# EAGLE design SensorIoTDisplay (EAGLE 9.6.1)
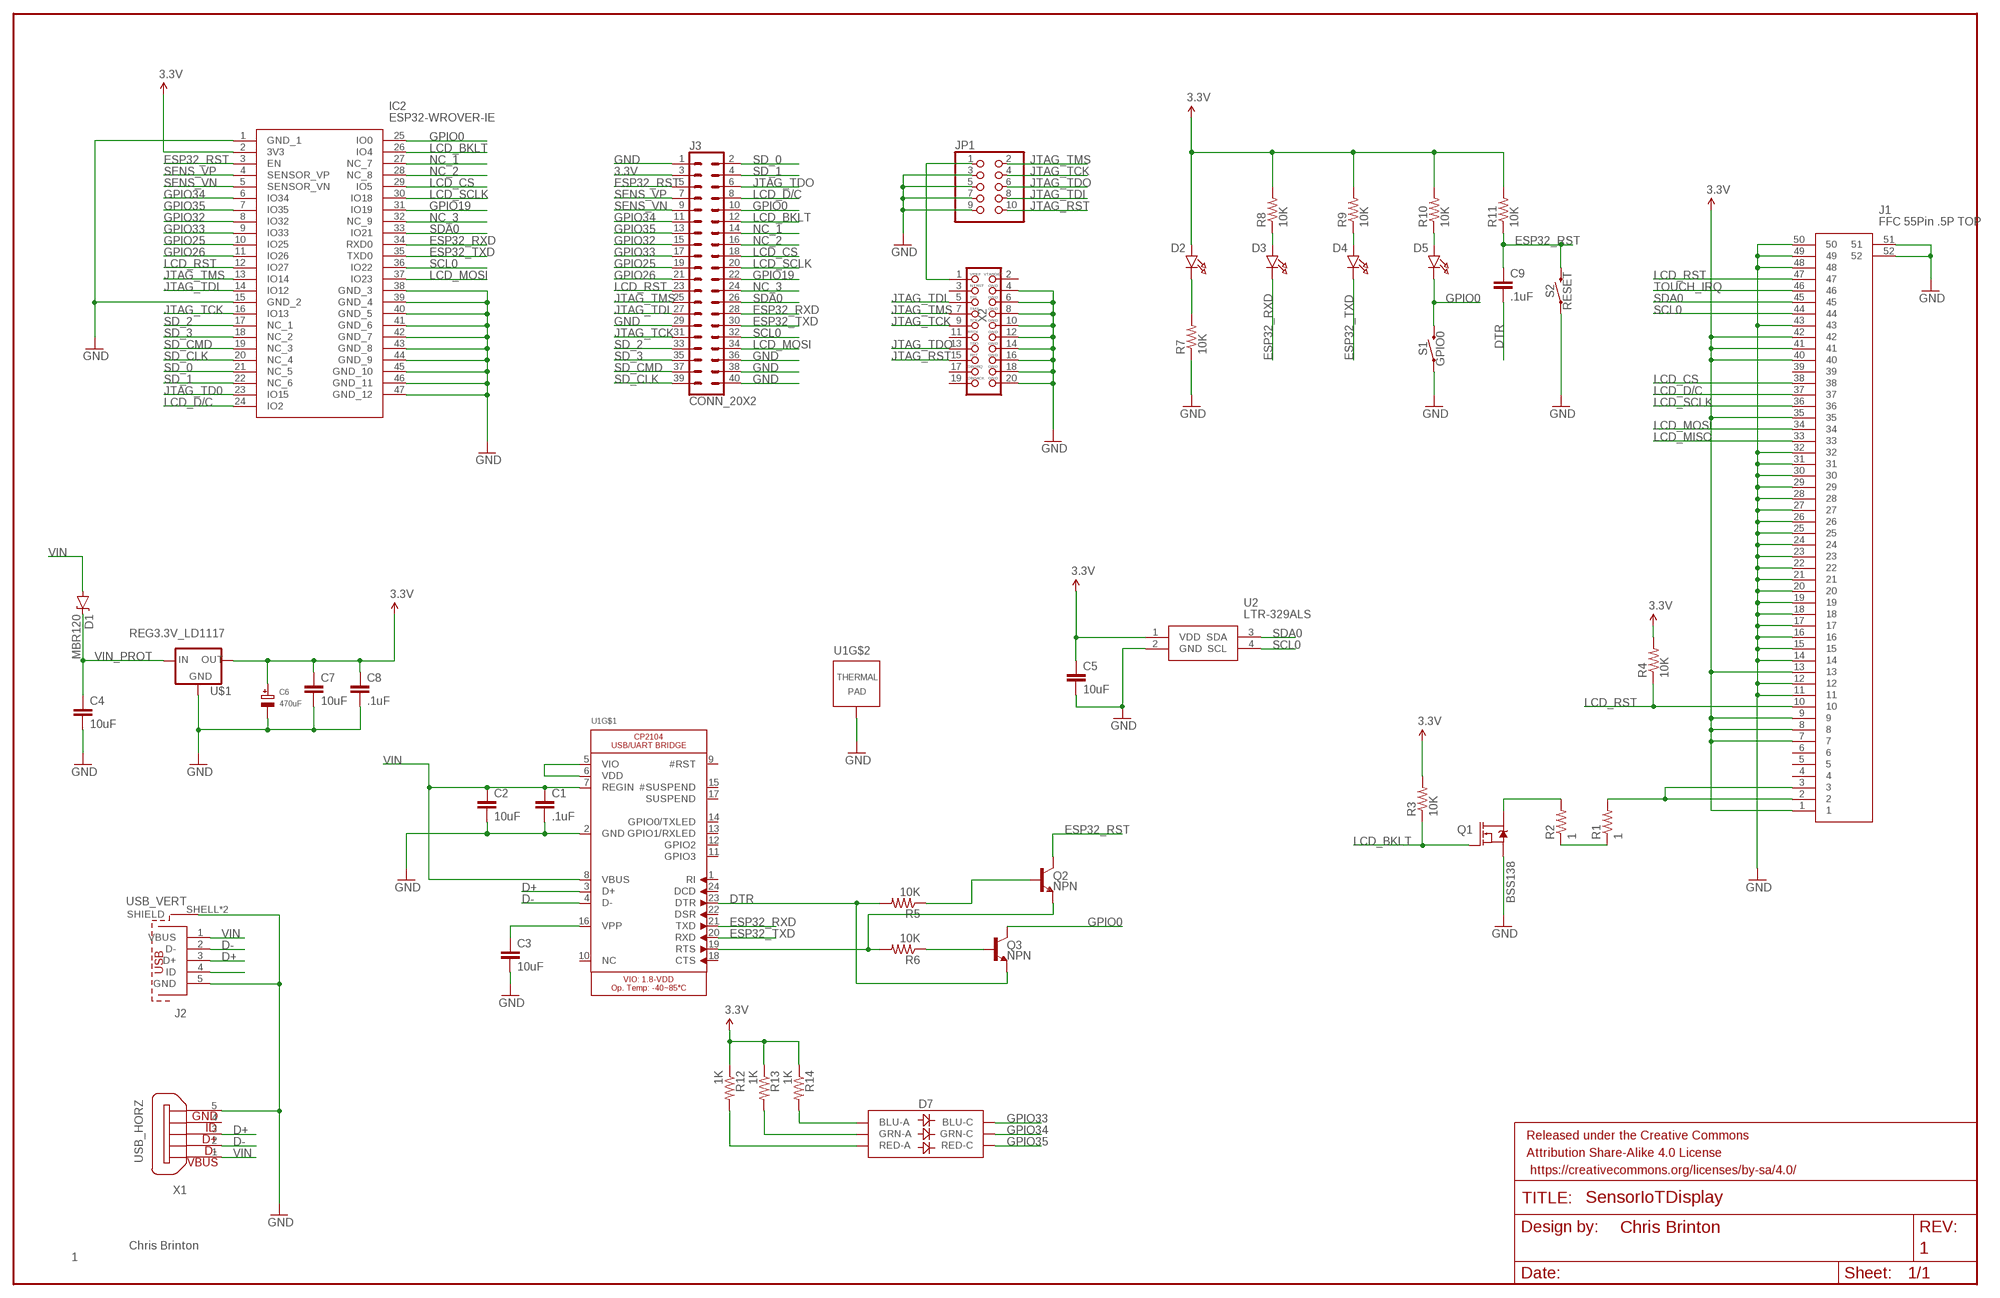
[diagram p0: schematic, sheet 1]

## Parts
C1  .1uF  CAP0805  [0805]
C2  10uF  CAP0805  [0805]
C3  10uF  CAP0805  [0805]
C4  10uF  CAP0805  [0805]
C5  10uF  CAP0805  [0805]
C6  470uF  CAP_TANTALUMD/7343_REFLOW  [EIA7343-31/D-R]
C7  10uF  CAP0805  [0805]
C8  .1uF  CAP0805  [0805]
C9  .1uF  CAP0805  [0805]
D1  MBR120  DIODE-ZENER16V  [SOD-123]
D2  RED  LED0805_NOOUTLINE  [CHIPLED_0805_NOOUTLINE]
D3  GREEN  LED0805_NOOUTLINE  [CHIPLED_0805_NOOUTLINE]
D4  BLUE  LED0805_NOOUTLINE  [CHIPLED_0805_NOOUTLINE]
D5  BLUE  LED0805_NOOUTLINE  [CHIPLED_0805_NOOUTLINE]
D7  LED-RGBNO_IC  [LED-TRICOLOR-5050]
FRAME1  FRAME-LEDGER  [CREATIVE_COMMONS]
IC2  ESP32-WROVER-IE  ESP32-WROVER-IE_M213EH6464UH3Q  [ESP32WROVERIEM213EH6464UH3Q0]
J1  FFC 55Pin .5P TOP  FH12A-50S-0.5SH_55_  [FH12A50S05SH55]
J2  USB_VERT  614105150621  [614105150621]
J3  CONN_20X2  [2X20]
JP1  HEADER-2X51.27MM  [2X05_1.27MM_SMT]
Q1  BSS138  MOSFET-NCH-BSS138  [SOT23-3]
Q2  NPN  TRANS_NPN-MMBT2222AL  [SOT23-3]
Q3  NPN  TRANS_NPN-MMBT2222AL  [SOT23-3]
R1  1  RESISTOR0805-RES  [0805]
R2  1  RESISTOR0805-RES  [0805]
R3  10K  RESISTOR0805-RES  [0805]
R4  10K  RESISTOR0805-RES  [0805]
R5  10K  RESISTOR0805-RES  [0805]
R6  10K  RESISTOR0805-RES  [0805]
R7  10K  RESISTOR0805-RES  [0805]
R8  10K  RESISTOR0805-RES  [0805]
R9  10K  RESISTOR0805-RES  [0805]
R10  10K  RESISTOR0805-RES  [0805]
R11  10K  RESISTOR0805-RES  [0805]
R12  1K  RESISTOR0805-RES  [0805]
R13  1K  RESISTOR0805-RES  [0805]
R14  1K  RESISTOR0805-RES  [0805]
S1  GPIO0  MOMENTARY-SWITCH-SPST-SMD-4.6X2.8MM  [TACTILE_SWITCH_SMD_4.6X2.8MM]
S2  RESET  MOMENTARY-SWITCH-SPST-SMD-4.6X2.8MM  [TACTILE_SWITCH_SMD_4.6X2.8MM]
U1  CP2104  [QFN24_4MM_SMSC]
U2  LTR-329ALS  LTR-329ALS-01  [LTR329ALS01]
U$1  REG3.3V_LD1117  V_REG_LD1117VXXLD1117-SMD  [SOT223]
X1  USB_HORZ  ZX62D-B-5PA8  [ZX62D-B-5PA8]
X2  MICROBUILDER_JTAG-ARM7SMT_FEMALE  [MICROBUILDER_2X10_SMT_FEMALE]

## Nets
3.3V: C5.1 C6.+ C7.1 C8.1 D2.A IC2.2(3V3) J1.1 J1.7 J1.8 J1.9 J1.13 J1.35 J1.40 J1.41 J1.42 J3.3 R3.2 R4.2 R8.2 R9.2 R10.2 R11.2 R12.1 R13.1 R14.1 U2.1(VDD) U$1.2(OUT)
D+: J2.3(D+) U1.3(D+) X1.3
D-: J2.2(D-) U1.4(D-) X1.2
DTR: C9.2 Q3.2(E) R5.2 U1.23(DTR)
ESP32_RST: C9.1 IC2.3(EN) J3.5 Q2.3(C) R11.1 S2.3 S2.4
ESP32_RXD: D3.C IC2.34(RXD0) J3.28 U1.21(TXD)
ESP32_TXD: D4.C IC2.35(TXD0) J3.30 U1.20(RXD)
GND: C1.2 C2.2 C3.2 C4.2 C5.2 C6.- C7.2 C8.2 IC2.1(GND_1) IC2.15(GND_2) IC2.38(GND_3) IC2.39(GND_4) IC2.40(GND_5) IC2.41(GND_6) IC2.42(GND_7) IC2.43(GND_8) IC2.44(GND_9) IC2.45(GND_10) IC2.46(GND_11) IC2.47(GND_12) J1.11 J1.12 J1.14 J1.15 J1.16 J1.17 J1.18 J1.19 J1.20 J1.21 J1.22 J1.23 J1.24 J1.25 J1.26 J1.27 J1.28 J1.29 J1.30 J1.31 J1.32 J1.43 J1.48 J1.49 J1.50 J1.51 J1.52 J2.5(GND) J2.SHELL1(SHIELD) J2.SHELL(SHIELD) J3.1 J3.29 J3.36 J3.38 J3.40 JP1.3 JP1.5 JP1.7 JP1.9 Q1.2(S) R7.1 S1.1 S1.2 S2.1 S2.2 U1.2(GND) U1.THERM(TP) U2.2(GND) U$1.1(GND) X1.5 X2.4 X2.6 X2.8 X2.10 X2.12 X2.14 X2.16 X2.18 X2.20
GPIO0: D5.C IC2.25(IO0) J3.10 Q3.3(C) S1.3 S1.4
GPIO19: IC2.31(IO19) J3.22
GPIO25: IC2.10(IO25) J3.19
GPIO26: IC2.11(IO26) J3.21
GPIO32: IC2.8(IO32) J3.15
GPIO33: D7.4(BLU-C) IC2.9(IO33) J3.17
GPIO34: D7.6(GRN-C) IC2.6(IO34) J3.11
GPIO35: D7.5(RED-C) IC2.7(IO35) J3.13
JTAG_RST: JP1.10 X2.15
JTAG_TCK: IC2.16(IO13) J3.31 JP1.4 X2.9
JTAG_TD0: IC2.23(IO15)
JTAG_TDI: IC2.14(IO12) J3.27 JP1.8 X2.5
JTAG_TDO: J3.6 JP1.6 X2.13
JTAG_TMS: IC2.13(IO14) J3.25 JP1.2 X2.7
LCD_BKLT: IC2.26(IO4) J3.12 Q1.1(G) R3.1
LCD_CS: IC2.29(IO5) J1.38 J3.18
LCD_D/C: IC2.24(IO2) J1.37 J3.8
LCD_MISO: J1.33
LCD_MOSI: IC2.37(IO23) J1.34 J3.34
LCD_RST: IC2.12(IO27) J1.10 J1.47 J3.23 R4.1
LCD_SCLK: IC2.30(IO18) J1.36 J3.20
N$1: R1.1 R2.1
N$2: J1.2 J1.3 R1.2
N$3: Q1.3(D) R2.2
N$4: U1.5(VIO) U1.6(VDD)
N$6: C3.1 U1.16(VPP)
N$7: D7.1(GRN-A) R13.2
N$8: J2.4(ID)
N$9: Q2.2(E) R6.2 U1.19(RTS)
N$10: Q3.1(B) R6.1
N$11: Q2.1(B) R5.1
N$12: D2.C R7.2
N$13: D7.2(RED-A) R12.2
N$14: D7.3(BLU-A) R14.2
N$15: D3.A R8.1
N$16: D4.A R9.1
N$17: D5.A R10.1
N$80: JP1.1 X2.1
NC_1: IC2.27(NC_7) J3.14
NC_2: IC2.28(NC_8) J3.16
NC_3: IC2.32(NC_9) J3.24
SCL0: IC2.36(IO22) J1.44 J3.32 U2.4(SCL)
SD_0: IC2.21(NC_5) J3.2
SD_1: IC2.22(NC_6) J3.4
SD_2: IC2.17(NC_1) J3.33
SD_3: IC2.18(NC_2) J3.35
SD_CLK: IC2.20(NC_4) J3.39
SD_CMD: IC2.19(NC_3) J3.37
SDA0: IC2.33(IO21) J1.45 J3.26 U2.3(SDA)
SENS_VN: IC2.5(SENSOR_VN) J3.9
SENS_VP: IC2.4(SENSOR_VP) J3.7
TOUCH_IRQ: J1.46
VIN: C1.1 C2.1 D1.A J2.1(VBUS) U1.7(REGIN) U1.8(VBUS) X1.1
VIN_PROT: C4.1 D1.C U$1.3(IN)
Unconnected: J1.4 J1.5 J1.6 J1.39 U1.1(RI) U1.9(#RST) U1.10(NC) U1.11(GPIO3) U1.12(GPIO2) U1.13(GPIO1/RXLED) U1.14(GPIO0/TXLED) U1.15(#SUSPEND) U1.17(SUSPEND) U1.18(CTS) U1.22(DSR) U1.24(DCD) X1.4 X1.S1 X1.S2 X1.S3 X1.S4 X2.2 X2.3 X2.11 X2.17 X2.19

## Library data of the parts
C1-C5 C7-C9 = SparkFun-Passives:CAP: Capacitor Standard 0603 ceramic capacitor, and 0.1" leaded capacitor.
C6 = GDTech:CAP_TANTALUM: Tantalum Capacitors Wave footprints have larger pads and are meant to be used for hand soldering. Reflow footprints are optimised for solder paste and a reflow oven. EIA3216-18/A-[R/W] - Size A / 3216-18 / 1206 footprint 4.7µF 25V 10% Tantalum Capacitor 10µF 16V 10% Tantalum Capacitor [Digikey: 495-2236-2-ND] EIA3528-21/B-[R/W] - Size B / 3528-21 47µF 10V 10% Tantalum Capactior [Digikey: 495-2216-1-ND] EIA6032-28/C-[R/W] - Size C / 6032-28 10µF 35V 20% Tantalum Capacitor [Digikey: 495-2285-1-ND] 100µF 16V 10% Tantalum Capactior [Digikey: 399-5214-1-ND]
D1 = SparkFun-DiscreteSemi:DIODE-ZENER: Zener Diode Production Part - 8199 3.4V Zener Voltage; PROD_ID: DIO-12440; VALUE: 16V
D2-D5 = microbuilder:LED: LED 0603 - 0603 Surface Mount Package 2mA: Green LED - Low Power (3.9mcd, 2ma, 1.7Vf) - Digikey: 475-2709-2-ND Orange LED - Low Power (9.8mcd, 2ma, 1.8Vf) - Digikey: 475-1194-2-ND Red LED - Low Power (5mcd, 2ma, 1.8Vf) - Digikey: 475-1195-2-ND Yellow LED - Low Power (7mcd, 2ma, 1.8Vf) - Digikey: 475-1196-2-ND 5mA: Blue LED - Low Power (17mcd, 5ma, 2.9Vf) - Digikey: LNJ937W8CRACT-ND 0805 - 0805 Surface Mount Package 2mA: Red LED (8.8mcd, 2mA, 1.8Vf, Clear) - Low Power [Digikey: 475-2510-1-ND] Green LED (5mcd, 2mA, 1.8Vf, Clear) - Low Power [Digikey: 475-2730-1-ND] Yellow LED (11.3mcd, 2mA, 1.8Vf, Clear) - Low Power [Digikey: 475-2555-1-ND] 20mA: Red LED (104mcd, 20mA, Diffused) - LS R976 [Digikey: 475-1278-6-ND] Red LED (12mcd, 20mA, 2.0Vf, Clear) - APT2012EC [Digikey: 754-1128-1-ND] Green LED (15mcd, 20mA, 2.2Vf, Clear) - APT2012GC [Digikey: 754-1131-1-ND] Orange LED (160mcd, 20mA, 2.1Vf, Clear) - APT2012SECK [Digikey: 754-1130-1-ND] 1206 - 1206 Surface Mount Package Green LED (26mcd, 20mA, Diffused) - LG N971 [Digikey: 475-1407-6-ND] Red LED (15mcd, 20mA, Diffused) - LH N974 [Digikey: 475-1416-6-ND]
D7 = SparkFun-LED:LED-RGB: LED-RGB 6 pin RGB LED (no common connector) Packages: PLCC-6 LED-TRICOLOR-5050 - No built-in IC SparkFun Products: Digital Sandbox <https://www.sparkfun.com/products/12651> LED- SMD RGB <https://www.sparkfun.com/products/10866>; PROD_ID: DIO-10298
FRAME1 = SparkFun-Aesthetics:FRAME-LEDGER: Schematic Frame - Ledger Standard 11x14 US Ledger frame; DESIGNER: Chris Brinton; REV: 1
IC2 = SamacSys_Parts:ESP32-WROVER-IE_M213EH6464UH3Q: WiFi Modules (802.11) SMD Module ESP32-WROVER-IE, ESP32-D0WD-V3, 3.3V 64Mbit PSRAM, 8 MB SPI flash, IPEX connector Source: Datasheet <https://www.mouser.fr/datasheet/2/891/esp32_wrover_e_esp32_wrover_ie_datasheet_en-1855913.pdf>; DESCRIPTION: WiFi Modules (802.11) SMD Module ESP32-WROVER-IE, ESP32-D0WD-V3, 3.3V 64Mbit PSRAM, 8 MB SPI flash, IPEX connector; HEIGHT: 3.45mm; MANUFACTURER_NAME: Espressif Systems; MANUFACTURER_PART_NUMBER: ESP32-WROVER-IE(M213EH6464UH3Q0); MOUSER_PART_NUMBER: 356-ESP32WRVIE6464UC; MOUSER_PRICE-STOCK: https://www.mouser.co.uk/ProductDetail/Espressif-Systems/ESP32-WROVER-IEM213EH6464UH3Q0?qs=vmHwEFxEFR8dEk%2F0jf8bsw%3D%3D
J1 = SamacSys_Parts:FH12A-50S-0.5SH_55_: FFC,0.5mm Pitch,Top Contact,50way Hirose FH12 Series 0.5mm Pitch 50 Way Right Angle SMT Female FPC Connector, ZIF Top Contact Source: Datasheet <https://www.hirose.com/product/download/?distributor=digikey&type=2d&lang=en&num=FH12A-50S-0.5SH(55)>; ALLIED_NUMBER: R1051516; ALLIED_PRICE-STOCK: https://www.alliedelec.com/hirose-electric-fh12a-50s-0-5sh-55-/R1051516/; DESCRIPTION: FFC,0.5mm Pitch,Top Contact,50way Hirose FH12 Series 0.5mm Pitch 50 Way Right Angle SMT Female FPC Connector, ZIF Top Contact; HEIGHT: 2mm; MANUFACTURER_NAME: Hirose; MANUFACTURER_PART_NUMBER: FH12A-50S-0.5SH(55); MOUSER_PART_NUMBER: 798-FH12A-50S0.5SH55; MOUSER_PRICE-STOCK: https://www.mouser.co.uk/ProductDetail/Hirose-Connector/FH12A-50S-05SH55?qs=Ux3WWAnHpjCW291jqAYF8g%3D%3D; RS_PART_NUMBER: 6882833P; RS_PRICE-STOCK: http://uk.rs-online.com/web/p/products/6882833P
J2 = 614105150621:614105150621: WR-COM_USB_Micro Type AB_Vertical_THT; Micro Type AB Vertical THT - Tape & Reel not for Pick & Place machine Code : Con_I-O_COM_USB_2.0_AB_614105150621_614105150621 <http://katalog.we-online.de/media/images/eican/Con_I-O_COM_USB_2.0_AB_614105150621_pf2.jpg> Details see: http://katalog.we-online.de/em/datasheet/614105150621.pdf Created 12/08/2014, Dan Xu 2014 (C) Wurth Elektronik; AVAILABILITY: Unavailable; DESCRIPTION: Vertical Through Hole; Ver 2.0 Micro USB Connector Socket, 30 V ac, 1.8A WR-COM; MF: Wurth Electronics; MP: 614105150621; PACKAGE: None; PRICE: None
J3 = SparkFun-Connectors:CONN_20X2: Multi connection point. Often used as Generic Header-pin footprint for 0.1 inch spaced/style header connections On any of the 0.1 inch spaced packages, you can populate with these: Break Away Headers - Straight <https://www.sparkfun.com/products/116> (PRT-00116) Break Away Male Headers - Right Angle <https://www.sparkfun.com/products/553> (PRT-00553) Female Headers <https://www.sparkfun.com/products/115> (PRT-00115) Break Away Headers - Machine Pin <https://www.sparkfun.com/products/117> (PRT-00117) Break Away Female Headers - Swiss Machine Pin <https://www.sparkfun.com/products/743> (PRT-00743)
JP1 = microbuilder:HEADER-2X5: PIN HEADER
Q1 = SparkFun-DiscreteSemi:MOSFET-NCH: N-channel MOSFETs Voltage controlled devices that allow control of high current outputs. SparkFun Products: SparkFun OpenScale <https://www.sparkfun.com/products/13261> SparkFun Digital Sandbox <https://www.sparkfun.com/products/12651> SparkFun Monster Moto Shield <https://www.sparkfun.com/products/10182> SparkFun MOSFET Power Controller <https://www.sparkfun.com/products/11214>; PROD_ID: TRANS-00830; VALUE: 220mA/50V/3.5Ω
Q2 Q3 = SparkFun-DiscreteSemi:TRANS_NPN: NPN transistor Current controlled devices typically used to amplify current or used as a switch. BC547 - COM-08928 <http://www.sparkfun.com/products/8928> (TO-92 45V 100mA) (1.Collector 2.Base 3.Emitter) 2N3904 - COM-00521 <http://www.sparkfun.com/products/521> (TO-92 40V 200mA) (1.Emitter 2.Base 3.Collector) P2N2222A - COM-12852 <http://www.sparkfun.com/products/12852> (TO-92 40V 600mA) (1.Collector 2.Base 3.Emitter); PROD_ID: TRANS-08049; VALUE: 600mA/40V
R1-R14 = SparkFun-Passives:RESISTOR: Resistor Basic schematic elements and footprints for 0603, 1206, and PTH resistors.
S1 S2 = SparkFun-Switches:MOMENTARY-SWITCH-SPST: Momentary Switch (Pushbutton) - SPST Normally-open (NO) SPST momentary switches (buttons, pushbuttons). Variants PTH-12MM - 12mm square, through-hole Momentary Pushbutton Switch - 12mm Square <https://www.sparkfun.com/products/9190> (COM-09190) PTH-6.0MM, PTH-6.0MM-KIT - 6.0mm square, through-hole Mini Pushbutton Switch <https://www.sparkfun.com/products/97> (COM-00097) KIT package intended for soldering kit's - only one side of pads' copper is exposed. PTH-RIGHT-ANGLE-KIT - Right-angle, through-hole Right Angle Tactile Button <https://www.sparkfun.com/products/10791> - Used on SparkFun BigTime Watch Kit <https://www.sparkfun.com/products/11734> SMD-12MM - 12mm square, surface-mount Tactile Button - SMD (12mm) <https://www.sparkfun.com/products/12993> (COM-12993) Used on SparkFun PicoBoard <https://www.sparkfun.com/products/11888> SMD-4.5MM - 4.5mm Square Trackball Switch Used on SparkFun Blackberry Trackballer Breakout <https://www.sparkfun.com/products/13169> SMD-4.6MMX2.8MM - 4.60mm x 2.80mm, surface mount Used on SparkFun SAMD21 Mini Breakout <https://www.sparkfun.com/products/13664> SMD-5.2MM, SMD-5.2-REDUNDANT - 5.2mm square, surface-mount Mini Pushbutton Switch - SMD <https://www.sparkfun.com/products/8720> (COM-08720) Used on Arduino Pro Mini <https://www.sparkfun.com/products/11114> REDUNDANT package connects both switch circuits together SMD-6.0X3.5MM - 6.0 x 3.5mm, surface mount Momentary Reset Switch SMD <https://www.sparkfun.com/products/8229> (COM-08229) SMD-6.2MM-TALL - 6.2mm square, surface mount Tactile Button - SMD (6mm) <https://www.sparkfun.com/products/12992> Used on SparkFun Digital Sandbox <https://www.sparkfun.com/products/12651> SMD-RIGHT-ANGLE - Right-angle, surface mount Used on SparkFun Block for Intel® Edison - Arduino <https://www.sparkfun.com/products/13036>; PROD_ID: SWCH-13065
U1 = GDTech:CP2104: CP2104 - USB to UART Bridge VDD Output: 3.45V
U2 = SamacSys_Parts:LTR-329ALS-01: Ambient Light Sensors Ambient Light Photo Sensor Source: Datasheet <http://www.mouser.com/ds/2/239/liteon_LTR-329ALS-01-1175539.pdf>; DESCRIPTION: Ambient Light Sensors Ambient Light Photo Sensor; HEIGHT: 0mm; MANUFACTURER_NAME: Lite-On; MANUFACTURER_PART_NUMBER: LTR-329ALS-01; MOUSER_PART_NUMBER: 859-LTR-329ALS-01; MOUSER_PRICE-STOCK: https://www.mouser.com/Search/Refine.aspx?Keyword=859-LTR-329ALS-01
U$1 = SparkFun-IC-Power:V_REG_LD1117VXX: LD1117VXX voltage regulator. We carry the 3.3V version (COM-00526) in TO-220 package.; PROD_ID: VREG-13917
X1 = GDTech:ZX62D-B-5PA8: Micro USB Type B Connector - Standard, Shell Through Hole Source: http://www.hirose.co.jp/cataloge_hp/ed_ZX_20140804.pdf; MF: Hirose; MPN: ZX62D-B-5PA8; OC_FARNELL: 2300438; OC_NEWARK: 69W0712
X2 = Adafruit JTAG to SWD Adapter:MICROBUILDER_JTAG-ARM7: 20 Pin JTAG Connector For use with ARM7, and ARM9. Supported by some Cortex M3 boards with SWJ-DP interfaces (dual SWP/JTAG support). PTH - 4UConnector: 03556 SMT_MALE - 4UConnector: 17654 SMT_FEMALE - 4UConnector: 03587

## Board
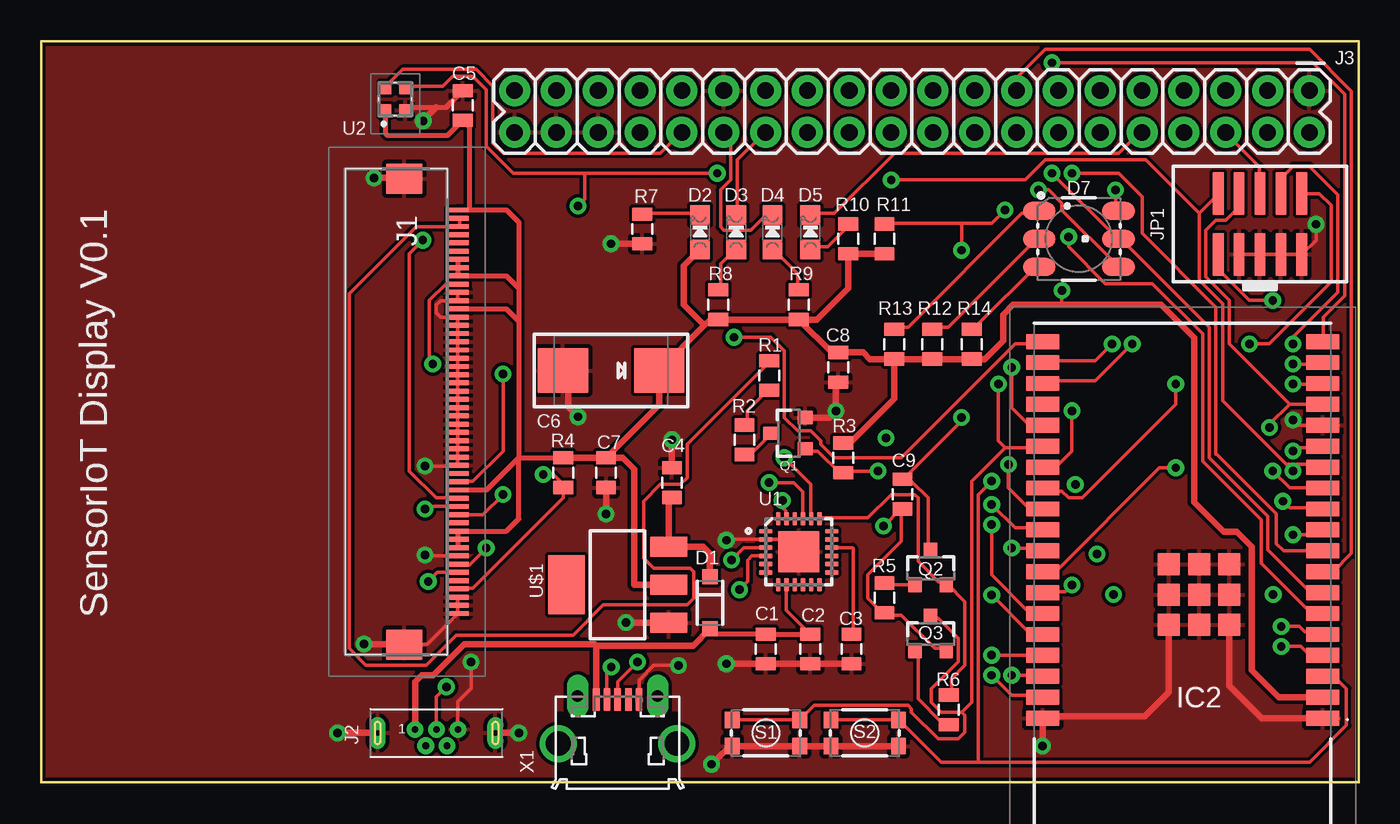
[diagram p1: board, top side]
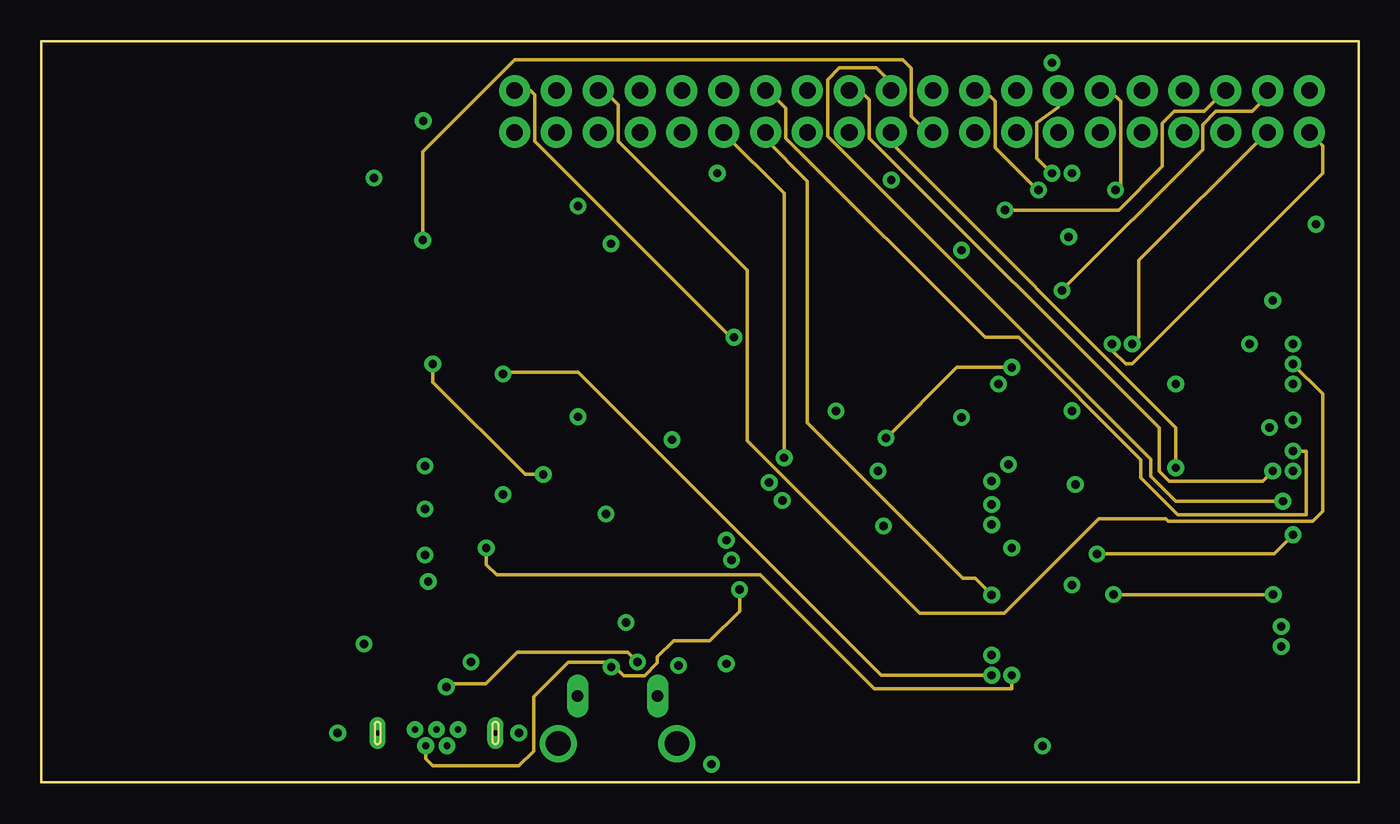
[diagram p2: board, inner layer Route2]
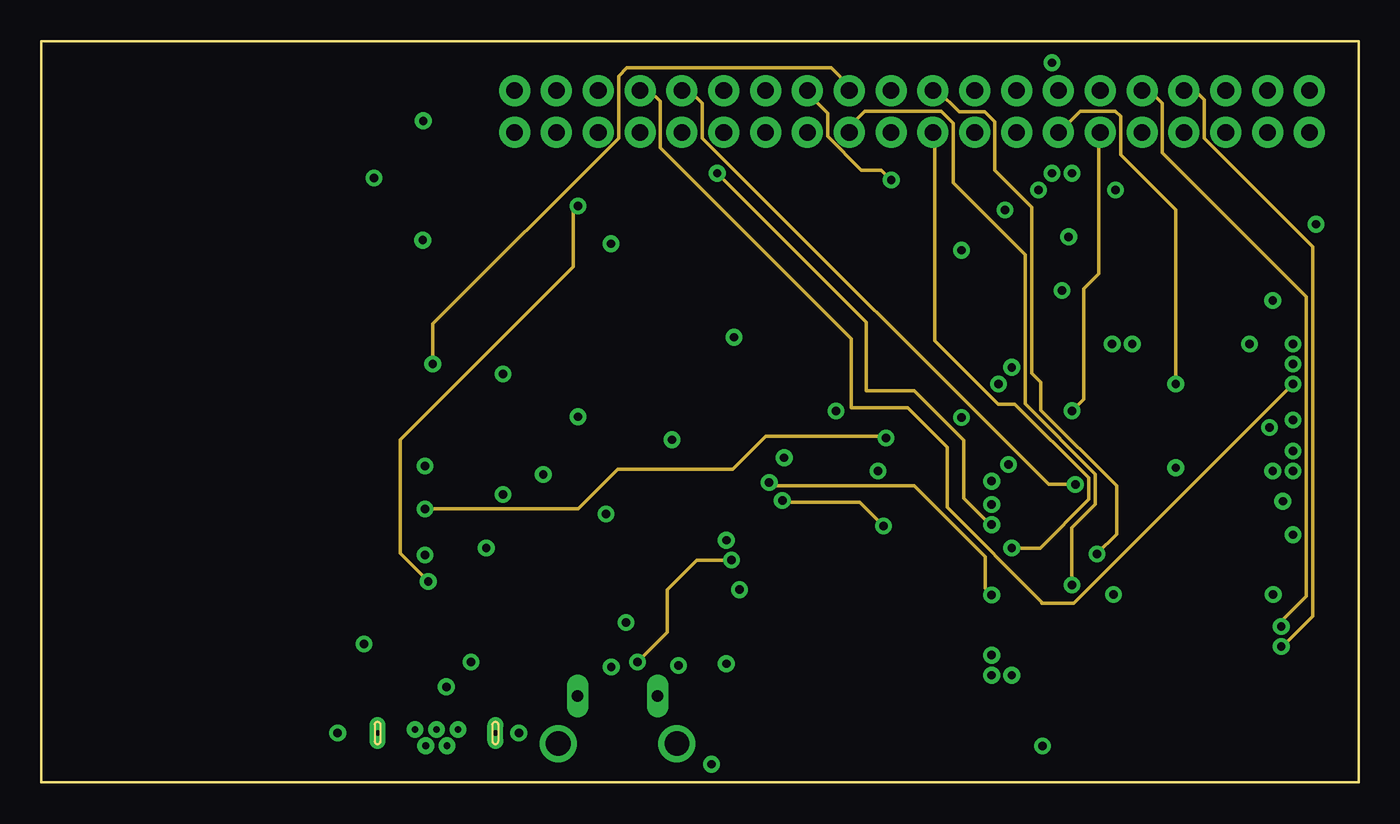
[diagram p3: board, inner layer Route15]
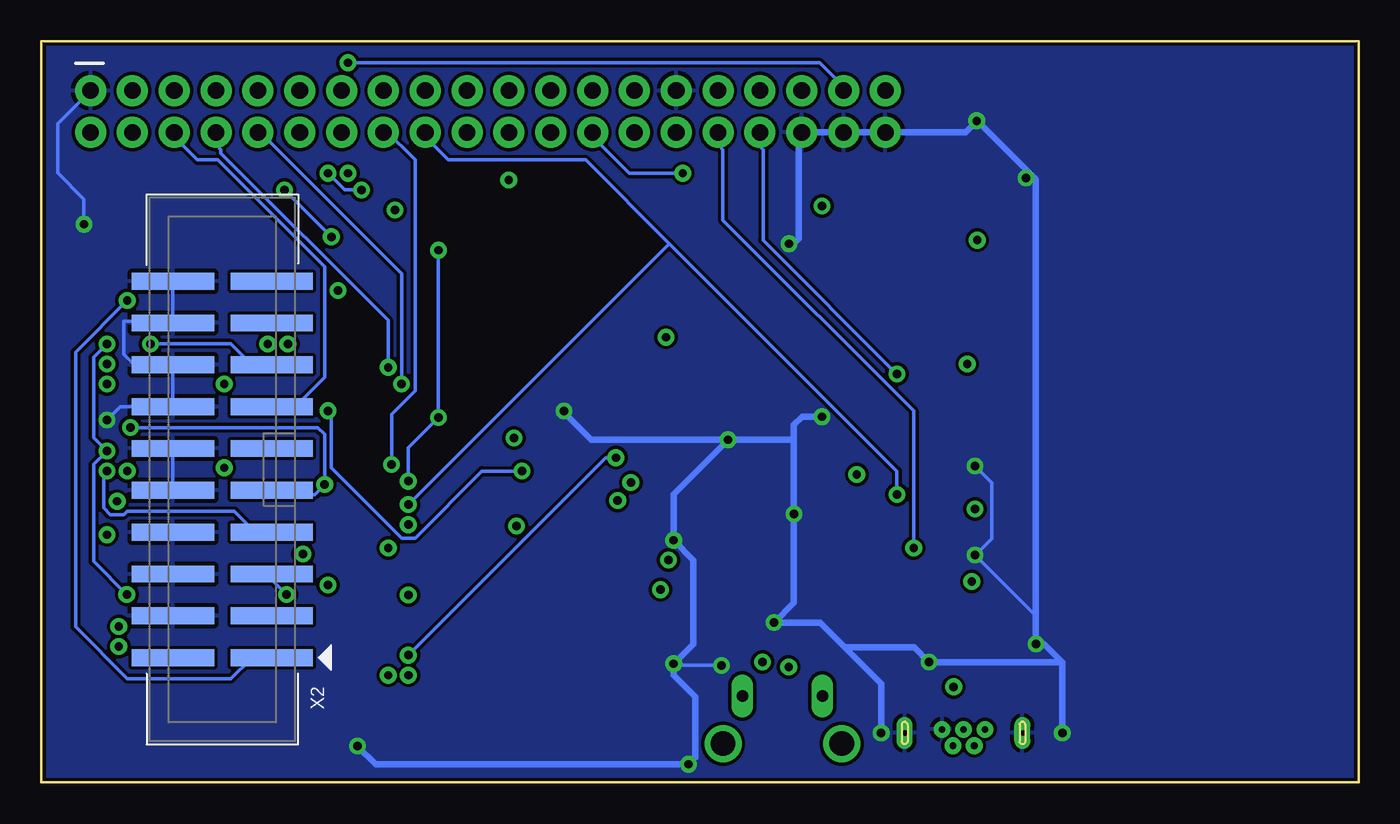
[diagram p4: board, bottom side, seen from below]

Size 80 x 45 mm. Coordinates in mm from the lower left corner, seen from the top.
Outline: 0,0 0,45 80,45 80,0 0,0
Copper layers (1+2*15+16): Top 0.035mm / dielectric 0.2mm / Route2 0.0175mm / dielectric 1.065mm / Route15 0.0175mm / dielectric 0.2mm / Bottom 0.035mm
Design rules "SparkFun *": minimum track width 8mil, minimum drill 20mil, track to track 8mil, track to pad 8mil, pad to pad 8mil, via to via 8mil, smd to smd 8mil, copper to edge 8mil, drill to drill 8mil, minimum pad ring 12mil, minimum via ring 10mil, stop-mask expansion 4mil, vias tented up to drill 20mil, thermal gap 10mil

### Footprints (pad centres in the part's own frame; a part is rotated, then mirrored left to right if it is on the bottom)
0805 = smd 0.8 x 1.2: 1 -0.9,0; 2 0.9,0
EIA7343-31/D-R = smd 3.048 x 2.7: + 2.921,0; - -2.921,0
SOD-123 = smd 0.9 x 0.95: A 1.575,0; C -1.575,0
CHIPLED_0805_NOOUTLINE = smd 1.2 x 1.2: A 0,-1.05; C 0,1.05
LED-TRICOLOR-5050 = smd 2 x 1.1: 1 -2.4,1.7; 2 -2.4,0; 3 -2.4,-1.7; 4 2.4,-1.7; 5 2.4,0; 6 2.4,1.7
ESP32WROVERIEM213EH6464UH3Q0 = smd 2 x 0.9: 1 0,0; 2 0,-1.27; 3 0,-2.54; 4 0,-3.81; 5 0,-5.08; 6 0,-6.35; 7 0,-7.62; 8 0,-8.89; 9 0,-10.16; 10 0,-11.43; 11 0,-12.7; 12 0,-13.97; 13 0,-15.24; 14 0,-16.51; 15 0,-17.78; 16 0,-19.05; 17 0,-20.32; 18 0,-21.59; 19 0,-22.86; 20 17,-22.86; 21 17,-21.59; 22 17,-20.32; 23 17,-19.05; 24 17,-17.78; 25 17,-16.51; 26 17,-15.24; 27 17,-13.97; 28 17,-12.7; 29 17,-11.43; 30 17,-10.16; 31 17,-8.89; 32 17,-7.62; 33 17,-6.35; 34 17,-5.08; 35 17,-3.81; 36 17,-2.54; 37 17,-1.27; 38 17,0 | smd 1.33 x 1.33: 39 7.5,-7.5; 40 7.5,-5.665; 41 9.335,-5.665; 42 9.335,-7.5; 43 9.335,-9.335; 44 7.5,-9.335; 45 5.665,-9.335; 46 5.665,-7.5; 47 5.665,-5.665
FH12A50S05SH55 = smd 0.3 x 1.3: 1 12.25,-3.1; 2 11.75,-3.1; 3 11.25,-3.1; 4 10.75,-3.1; 5 10.25,-3.1; 6 9.75,-3.1; 7 9.25,-3.1; 8 8.75,-3.1; 9 8.25,-3.1; 10 7.75,-3.1; 11 7.25,-3.1; 12 6.75,-3.1; 13 6.25,-3.1; 14 5.75,-3.1; 15 5.25,-3.1; 16 4.75,-3.1; 17 4.25,-3.1; 18 3.75,-3.1; 19 3.25,-3.1; 20 2.75,-3.1; 21 2.25,-3.1; 22 1.75,-3.1; 23 1.25,-3.1; 24 0.75,-3.1; 25 0.25,-3.1; 26 -0.25,-3.1; 27 -0.75,-3.1; 28 -1.25,-3.1; 29 -1.75,-3.1; 30 -2.25,-3.1; 31 -2.75,-3.1; 32 -3.25,-3.1; 33 -3.75,-3.1; 34 -4.25,-3.1; 35 -4.75,-3.1; 36 -5.25,-3.1; 37 -5.75,-3.1; 38 -6.25,-3.1; 39 -6.75,-3.1; 40 -7.25,-3.1; 41 -7.75,-3.1; 42 -8.25,-3.1; 43 -8.75,-3.1; 44 -9.25,-3.1; 45 -9.75,-3.1; 46 -10.25,-3.1; 47 -10.75,-3.1; 48 -11.25,-3.1; 49 -11.75,-3.1; 50 -12.25,-3.1 | smd 1.8 x 2.2: 51 -14.15,0.15; 52 14.15,0.15
614105150621 = drill 0.4: 1 -1.3,0.22; 2 -0.65,-0.78; 3 0,0.22; 4 0.65,-0.78; 5 1.3,0.22 | drill 0.35 pad 0.95 long: SHELL -3.575,0; SHELL1 3.575,0
2X20 = drill 1.016 pad 1.88: 1 0,0; 2 0,2.54; 3 2.54,0; 4 2.54,2.54; 5 5.08,0; 6 5.08,2.54; 7 7.62,0; 8 7.62,2.54; 9 10.16,0; 10 10.16,2.54; 11 12.7,0; 12 12.7,2.54; 13 15.24,0; 14 15.24,2.54; 15 17.78,0; 16 17.78,2.54; 17 20.32,0; 18 20.32,2.54; 19 22.86,0; 20 22.86,2.54; 21 25.4,0; 22 25.4,2.54; 23 27.94,0; 24 27.94,2.54; 25 30.48,0; 26 30.48,2.54; 27 33.02,0; 28 33.02,2.54; 29 35.56,0; 30 35.56,2.54; 31 38.1,0; 32 38.1,2.54; 33 40.64,0; 34 40.64,2.54; 35 43.18,0; 36 43.18,2.54; 37 45.72,0; 38 45.72,2.54; 39 48.26,0; 40 48.26,2.54
2X05_1.27MM_SMT = smd 0.65 x 2.6: 1 -2.54,-1.85; 2 -2.54,1.85; 3 -1.27,-1.85; 4 -1.27,1.85; 5 0,-1.85; 6 0,1.85; 7 1.27,-1.85; 8 1.27,1.85; 9 2.54,-1.85; 10 2.54,1.85
SOT23-3 = smd 0.8 x 0.9: 1 -0.95,-1; 2 0.95,-1; 3 0,1.1
TACTILE_SWITCH_SMD_4.6X2.8MM = smd 0.9 x 1: 1 -2.05,-0.8; 2 2.05,-0.8; 3 2.05,0.8; 4 -2.05,0.8
QFN24_4MM_SMSC = smd 0.8 x 0.28: 1 -2,1.25; 2 -2,0.75; 3 -2,0.25; 4 -2,-0.25; 5 -2,-0.75; 6 -2,-1.25; 13 2,-1.25; 14 2,-0.75; 15 2,-0.25; 16 2,0.25; 17 2,0.75; 18 2,1.25 | smd 0.28 x 0.8: 7 -1.25,-2; 8 -0.75,-2; 9 -0.25,-2; 10 0.25,-2; 11 0.75,-2; 12 1.25,-2; 19 1.25,2; 20 0.75,2; 21 0.25,2; 22 -0.25,2; 23 -0.75,2; 24 -1.25,2 | smd 2.5 x 2.5: THERM 0,0
LTR329ALS01 = smd 0.7 x 0.75: 1 -0.6,-0.4; 2 0.6,-0.4; 3 0.6,0.95; 4 -0.6,0.95
SOT223 = smd 1.219 x 2.235: 1 -2.311,-3.099; 2 0,-3.099; 3 2.311,-3.099 | smd 3.6 x 2.2: 4 0,3.099
ZX62D-B-5PA8 = smd 1.35 x 0.4: 1 4.825,1.3; 2 4.825,0.65; 3 4.825,0; 4 4.825,-0.65; 5 4.825,-1.3 | drill 1.5: S1 2.15,-3.6; S2 2.15,3.6 | drill 0.7 long: S3 5.05,2.425; S4 5.05,-2.425
MICROBUILDER_2X10_SMT_FEMALE = smd 1.02 x 5: 1 -11.43,-3; 2 -11.43,3; 3 -8.89,-3; 4 -8.89,3; 5 -6.35,-3; 6 -6.35,3; 7 -3.81,-3; 8 -3.81,3; 9 -1.27,-3; 10 -1.27,3; 11 1.27,-3; 12 1.27,3; 13 3.81,-3; 14 3.81,3; 15 6.35,-3; 16 6.35,3; 17 8.89,-3; 18 8.89,3; 19 11.43,-3; 20 11.43,3

### Placement (x,y rotation side)
C1  44,8.1 270 top
C2  46.7,8.1 270 top
C3  49.2,8.1 270 top
C4  38.3,18.2 90 top
C5  25.6,41.1 90 top
C6  34.6,25 0 top
C7  34.3,18.8 270 top
C8  48.4,25.2 270 top
C9  52.3,17.5 270 top
D1  40.6,10.9 270 top
D2  40,33.4 0 top
D3  42.2,33.4 0 top
D4  44.4,33.4 0 top
D5  46.7,33.4 0 top
D7  63,33 0 top
FRAME1  24.13,-7.62 0 top  (outside the outline)
IC2  77.8,3.9 180 top
J1  22.2,22.5 90 top
J2  24,3 0 top
J3  77,42 180 top
JP1  74,33.9 0 top
Q1  45.4,21.2 90 top
Q2  54,13 0 top
Q3  54,9 0 top
R1  44.2,24.7 90 top
R2  42.7,20.8 270 top
R3  48.7,19.7 90 top
R4  31.7,18.8 90 top
R5  51.2,11.2 270 top
R6  55.1,4.4 90 top
R7  36.5,33.6 90 top
R8  41.1,29 270 top
R9  46,29 270 top
R10  49,33 270 top
R11  51.2,33 270 top
R12  54.1,26.6 90 top
R13  51.8,26.6 90 top
R14  56.5,26.6 90 top
S1  44,3 0 top
S2  50,3 0 top
U1  46,14 0 top
U2  21.5,41.2 0 top
U$1  35,12 90 top
X1  35,0.2 90 top
X2  69,19 90 bottom

### Tracks (layer width: path | path; a pad name or v marks a point on that pad's centre or on a via)
3.3V  (via drill 0.51)
  Top 0.203: J1.41 25.4,14.83 25.3,14.83 | 26.01,34.75 26,34.76 | J1.8 25.4,31.29 25.3,31.29 | 61.98,29 v61.98,29.87
  Top 0.305: J1.35 27.05,17.75 29,19.7 | 29,19.7 R4.2 | 29,19.7 29,16 28.25,15.25 J1.40 25.3,14.83 J1.41 J1.42 | 29,28 29,19.7 | J1.13 28.25,28.75 29,28 | J1.7 25.3,31.29 J1.8 J1.9 28.25,30.75 29,30 | 29,30 29,28 | J1.1 26.01,34.75 28.25,34.75 29,34 29,30 | 26,34.76 26,39.8 C5.1 24.7,39.3 21,39.3 20.9,39.4 U2.1
  Top 0.406: U$1.2 36,12 36,19 35.3,19.7 C7.1 | C7.1 R4.2 | C7.1 37.52,22.92 C6.+ 40.26,27.74 | 40.26,27.74 40.62,28.1 R8.2 R9.2 | D2.A 39,31.35 39,29 40.26,27.74 | R9.2 48,26.1 C8.1 49.9,26.1 50.3,25.7 R13.1 | R9.2 47.1,28.1 49,30 R10.2 R11.2 | R13.1 R12.1 R14.1 57.3,25.7 58.4,26.8 58.4,28.4 59,29 61.98,29 68,29 70,27 70,17 71.8,15.2 72.6,15.2 73.5,14.3 73.5,6.8 75.13,5.17 IC2.2 | R3.2 49.1,20.6 51.8,23.3 R13.1
  Route2 0.203: J3.3 74.46,41.66 73.54,40.74 71.33,40.74 70.51,39.92 70.51,38.41 v61.98,29.87
D+  (via drill 0.51)
  Top 0.203: J2.3 24,5.2 v24.6,5.8 | X1.3 35,6.1 v36.2,7.3 | v41.91,13.5 42.66,14.25 U1.3
  Route2 0.203: v24.6,5.8 24.8,6 27,6 28.9,7.9 35.6,7.9 v36.2,7.3
  Route15 0.203: v36.2,7.3 38,9.1 38,11.7 39.8,13.5 v41.91,13.5
D-  (via drill 0.51)
  Top 0.203: v34.61,7 34.35,6.74 X1.2 | U1.4 43.15,13.75 42.9,13.5 42.9,12.2 v42.4,11.7
  Route2 0.203: J2.2 23.35,1.42 23.77,1 29,1 29.9,1.9 29.9,5.2 32,7.3 34.31,7.3 v34.61,7 34.51,6.9 34.95,6.9 35.36,6.49 36.64,6.49 37.41,7.26 37.41,7.61 38.4,8.6 40.6,8.6 42.4,10.4 v42.4,11.7
DTR  (via drill 0.51)
  Top 0.203: Q3.2 54.86,8.13 54.25,8.13 52.22,10.16 51.21,10.16 R5.2 51,10.36 50.19,11.18 50.19,12.6 52.22,14.63 52.22,16.46 C9.2 52.19,16.6 v51.14,15.56 | U1.23 45.2,16.05 45.2,16.48 45,16.68 v45,17.11
  Route15 0.203: v45,17.11 45.11,17 49.7,17 v51.14,15.56
ESP32_RST  (via drill 0.51)
  Top 0.203: S2.4 S2.3 52.22,3.66 54.66,1.22 56.9,1.22 | 56.9,1.22 77.01,1.22 79.25,3.45 79.25,5.69 78.64,6.3 77.83,6.3 IC2.3 | Q2.3 53.85,14.22 53.85,17.27 52.83,18.29 52.43,18.29 C9.1 52.43,18.49 55.88,21.95 v55.88,22.15 | 55.88,33.93 57.71,33.93 v58.52,34.75 | 55.88,33.93 51.21,33.93 R11.1 | 55.88,33.93 v55.88,32.31 | 56.9,1.22 56.9,17.48 v57.71,18.29
  Route2 0.203: v58.52,34.75 65.43,34.75 68.08,37.4 68.08,40.03 68.79,40.74 70.61,40.74 71.73,41.86 J3.5
  Bottom 0.203: v55.88,32.31 v55.88,22.15 57.71,20.32 v57.71,18.29
ESP32_RXD  (via drill 0.51)
  Top 0.203: D3.C 42.27,34.54 42.27,37.8 43.89,39.42 J3.28 | v57.71,11.38 59.94,9.14 60.76,9.14 IC2.34 | U1.21 46.25,17.65 45.7,18.2 v44.2,18.2
  Route2 0.203: v57.71,11.38 56.71,12.38 55.96,12.38 46.52,21.82 46.52,36.5 43.98,39.03 J3.28
  Route15 0.203: v44.2,18.2 44.4,18 53,18 57.31,13.69 57.31,11.78 v57.71,11.38
ESP32_TXD  (via drill 0.51)
  Top 0.203: v45.11,19.71 46.74,18.09 46.74,16.05 U1.20 | D4.C 44.3,34.34 43.89,34.34 43.08,33.53 41.45,33.53 41.25,33.73 41.25,35.97 41.86,36.58 41.86,39.01 41.45,39.42 J3.30 | v57.71,7.72 60.76,7.72 IC2.35
  Route2 0.203: v45.11,19.71 45.11,35.76 41.45,39.42 J3.30
  Bottom 0.203: v57.71,7.72 45.72,19.71 v45.11,19.71
GND  (via drill 0.51)
  Top 0.203: J2.5 25.3,4.9 26.1,5.7 v26.1,7.3 | 22,8.4 23.45,8.4 J1.50 J1.49 J1.48 | J1.43 23.35,13.75 v23.3,13.8 | v23.3,19.2 24.52,19.2 25.25,19.2 J1.32 J1.31 J1.30 J1.29 J1.28 J1.27 J1.26 J1.25 J1.24 J1.23 J1.22 J1.21 J1.20 J1.19 J1.18 J1.17 J1.16 J1.15 J1.14 24.25,28.25 24,28.5 24,29 24.25,29.25 J1.12 J1.11 | v41.6,14.7 41.65,14.75 U1.2 45.25,14.75 U1.THERM | X1.5 36.3,6.2 37.2,7.1 v38.7,7.1 | IC2.15 76.32,21.68 v76,22 | JP1.3 JP1.5 JP1.7 JP1.9 77.4,32.91 v77.4,33.88
  Top 0.305: U2.2 22.3,41 24,41 24.6,41 C5.2
  Top 0.406: v19.6,8.4 22,8.4 J1.51 | J2.SHELL v18,3 | J2.SHELL1 v29,3 | U$1.1 35.51,9.69 v35.5,9.7 | v20.2,36.7 22,36.7 J1.52 | v23.2,40.16 23.2,40.2 24,41 | v32.6,22.2 32,22.8 32,25 C6.- | C7.2 v34.3,16.3 | C4.2 v38.3,20.8 | v41.6,7.2 C1.2 C2.2 C3.2 | v40.7,1.1 41.8,2.2 S1.1 S1.2 S2.1 S2.2 | v60.8,2.2 IC2.38 60.9,4 67,4 68.47,5.46 IC2.41 | IC2.1 74.1,3.9 72.14,5.87 IC2.47 | C8.2 48.25,24.15 v48.25,22.55 47.85,22.15 Q1.2 | v34.6,32.7 R7.1
  Bottom 0.203: v19.6,8.4 19.6,10.1 v23.3,13.8 22.3,14.8 22.3,18.2 v23.3,19.2 | v38.7,7.1 41.5,7.1 v41.6,7.2 | v76,22 75.19,22.81 X2.14 X2.16 74.35,25.35 75,26 75,28 72.11,28 X2.18 X2.20 | X2.12 X2.10 | v77.4,33.88 77.4,35.4 79,37 79,40 J3.1
  Bottom 0.406: v18,3 18,7.3 | 18,7.3 19.1,8.4 v19.6,8.4 19.6,36.6 19.7,36.7 | v29,3 29,6 31.2,8.2 | 31.2,8.2 32.7,9.7 v35.5,9.7 34.3,10.9 v34.3,16.3 34.3,20.8 | 19.7,36.7 v20.2,36.7 | 23.16,40.16 v23.2,40.16 | 19.7,36.7 23.16,40.16 | 34.3,20.8 34.3,21.7 33.8,22.2 v32.6,22.2 | v38.3,20.8 34.3,20.8 | v38.3,20.8 41.6,17.5 v41.6,14.7 40.4,13.5 40.4,8.4 v41.6,7.2 41.6,6.5 40.3,5.2 40.3,1.5 v40.7,1.1 59.7,1.1 v60.8,2.2 | v38.3,20.8 46.6,20.8 48.3,22.5 v48.25,22.55 | 31.2,8.2 27,8.2 v26.1,7.3 18,7.3 | 23.16,40.16 23.87,39.46 J3.40 J3.38 J3.36 34,39.28 34,33 34.3,32.7 v34.6,32.7
  pour Bottom: 0,45 80,45 80,0 0,0
  pour Top: 0,45 80,45 80,0 0,0
GPIO0  (via drill 0.51)
  Top 0.203: S1.4 S1.3 46.13,3.86 46.94,4.67 52.63,4.67 52.83,4.47 52.83,4.27 54.46,2.64 55.68,2.64 56.08,3.05 56.08,4.06 55.88,4.27 | D5.C 46.74,34.54 48.16,34.54 51.82,38.2 65.43,38.2 66.65,39.42 J3.10 | 55.88,4.27 54.66,4.27 54.05,4.88 54.05,5.69 55.68,7.32 55.68,8.74 54.46,9.96 54.05,9.96 Q3.3 | 58.52,20.32 60.76,20.32 IC2.25 | 58.52,20.32 56.49,18.29 56.49,4.88 55.88,4.27 | v58.12,24.18 58.12,20.73 58.52,20.32
  Bottom 0.203: v58.12,24.18 58.12,30.89 66.65,39.42 J3.10
GPIO19  (via drill 0.51)
  Top 0.203: v68.89,19.1 67.89,19.1 61.59,12.8 60.96,12.8 IC2.31
  Route2 0.203: v68.89,19.1 68.89,21.54 51.91,38.52 | 51.91,38.52 | 51.91,38.52 J3.22
GPIO25  (via drill 0.51)
  Top 0.203: v76,15.04 77.51,15.04 IC2.10
  Route2 0.203: v64.1,13.87 74.87,13.87 76,15 v76,15.04
  Route15 0.203: J3.19 54.44,42 55.74,40.7 57.3,40.7 57.9,40.1 57.9,37.16 60.15,34.92 60.15,24.85 60.7,24.3 60.7,22.6 65.3,18 65.3,15.07 v64.1,13.87
GPIO26  (via drill 0.51)
  Top 0.203: v75.39,17.07 75.79,16.66 77.62,16.66 IC2.11
  Route2 0.203: v75.39,17.07 68.89,17.07 67.37,18.59 67.37,19.6 47.76,39.21 47.76,42.67 48.47,43.38 50.69,43.38 51.6,42.47 J3.21
GPIO32
  Top 0.203: IC2.8 77.83,12.8 78.44,12.8 79.55,13.91 79.55,41.97 77.01,44.5 60.96,44.5 59.33,42.88 59.33,42.06 J3.15
GPIO33  (via drill 0.51)
  Top 0.203: v60.55,35.97 61.16,35.97 61.98,35.15 61.98,34.75 65.23,31.5 D7.4 | v62.59,36.98 65.43,36.98 66.85,35.56 66.85,33.33 71.32,28.85 71.32,19.91 71.39,19.91 75,16.3 75,14.5 75.44,14.06 IC2.9
  Route2 0.203: v60.55,35.97 60.46,35.97 57.91,38.52 57.91,41.34 57.25,42 J3.17
  Bottom 0.203: v62.59,36.98 61.57,35.97 v60.55,35.97
GPIO34  (via drill 0.51)
  Top 0.203: v65.23,35.97 65.23,34.75 D7.6 | v62.38,33.12 62.38,32.51 64.62,30.28 67.46,30.28 70.51,27.23 70.51,19.51 74.07,15.94 74.07,13.3 77.01,10.36 77.62,10.36 IC2.6
  Route2 0.203: v65.23,35.97 65.53,36.27 65.53,41.34 64.87,42 J3.11
  Bottom 0.203: v65.23,35.97 v62.38,33.12
GPIO35  (via drill 0.51)
  Top 0.203: IC2.7 77.62,11.58 77.01,11.58 74.48,14.11 74.48,16.15 70.92,19.71 70.92,27.64 65.43,33.12 D7.5 65.23,33.12 v61.37,36.98
  Route2 0.203: v61.37,36.98 60.45,37.9 60.45,40.03 61.76,41 J3.13
JTAG_RST  (via drill 0.51)
  Top 0.203: JP1.10 77.59,35.75 78.32,35.03 78.32,30.38 74.56,26.62 v73.36,26.62
  Bottom 0.203: v73.36,26.62 68.48,26.62 67.26,25.4 66.04,25.4 X2.15
JTAG_TCK  (via drill 0.51)
  Top 0.203: 75.79,22.96 77.62,22.96 IC2.16 | 75.79,22.96 72.14,26.62 72.14,29.26 70.71,30.68 70.71,33.53 71.32,34.14 71.93,34.14 72.54,34.75 72.54,35.56 JP1.4 | 75.79,22.96 74.57,21.74 v74.57,21.54
  Route15 0.203: J3.31 39.36,42 40.13,41.23 40.13,39.11 61.16,18.09 v62.79,18.09
  Bottom 0.203: X2.9 65.84,17.68 65.63,17.48 63.4,17.48 v62.79,18.09 62.79,21.13 63.2,21.54 v74.57,21.54
JTAG_TDI  (via drill 0.51)
  Top 0.203: v76,20.12 76.2,20.32 77.62,20.32 IC2.14 | v76,26.62 76,27.03 78.72,29.75 78.72,35.68 77.01,37.39 76,37.39 75.39,36.78 75.39,35.76 JP1.8
  Route2 0.203: J3.27 44.14,42 45.21,40.93 45.21,39.11 57.32,27.01 59.35,27.01 66.76,19.6 66.76,18.49 68.99,16.26 76.81,16.26 76.81,20.12 v76,20.12 | v65.1,11.4 v74.8,11.4
  Bottom 0.203: v74.8,11.4 76.81,13.41 76.81,19.3 v76,20.12 76.81,20.93 76.81,25.81 v76,26.62 | X2.5 66,12.3 v65.1,11.4
JTAG_TDO
  Top 0.203: JP1.6 73.97,35.76 73.97,37.39 71.93,39.42 J3.6
  Bottom 0.203: X2.13 65.84,22.96 64.41,22.96 62.79,24.59 62.79,31.29 69.29,37.8 70.51,37.8 71.73,39.01 71.73,39.42 J3.6
JTAG_TMS  (via drill 0.51)
  Top 0.203: 76,19.3 75.59,19.3 71.73,23.16 71.73,29.06 70.31,30.48 70.31,34.54 | 76,19.3 77.62,19.3 IC2.13 | 70.31,34.54 71.32,35.56 JP1.2 | v51.61,36.58 59.74,36.58 60.96,37.8 67.06,37.8 70.31,34.54 | 76,19.3 v76,18.9
  Route15 0.203: v51.61,36.58 51.01,37.18 49.79,37.18 47.76,39.21 47.76,40.62 46.53,41.85 46.53,41.86 J3.25
  Bottom 0.203: v76,18.9 76.2,18.69 76.2,16.66 75.79,16.26 74.98,16.26 74.78,16.46 68.28,16.46 67.06,15.24 66.04,15.24 X2.7
LCD_BKLT  (via drill 0.51)
  Top 0.203: Q1.1 46.53,20.12 47.14,20.12 48.56,18.69 R3.1 48.77,18.9 v50.8,18.9 | v62.59,22.55 62.59,20.12 61.77,19.3 60.96,19.3 IC2.26
  Route15 0.203: v62.59,22.55 63.29,23.25 63.29,29.96 64.21,30.89 64.21,38.78 64.3,38.82 J3.12
  Bottom 0.203: v50.8,18.9 53.24,18.9 57.3,14.83 58.12,14.83 62.38,19.1 62.38,22.35 v62.59,22.55
LCD_CS  (via drill 0.51)
  Top 0.203: v28.04,17.48 26.82,16.26 25.4,16.26 J1.38 | v57.71,16.87 59.13,15.44 60.76,15.44 IC2.29
  Bottom 0.203: v28.04,17.48 28.04,18.9 41.86,32.72 | 41.86,32.72 46.94,37.8 55.27,37.8 56.49,39.01 56.49,39.42 J3.18 | 41.86,32.72 v57.71,16.87
LCD_D/C  (via drill 0.51)
  Top 0.203: v58.93,25.2 58.93,22.76 59.94,21.74 60.76,21.74 IC2.24 | J1.37 23.45,16.75 v23.3,16.6
  Route2 0.203: v51.3,20.9 55.6,25.2 v58.93,25.2
  Route15 0.203: v23.3,16.6 32.6,16.6 35,19 42,19 44,21 51.2,21 v51.3,20.9
  Bottom 0.203: v58.93,25.2 58.93,28.04 69.09,38.2 69.09,38.41 69.29,38.61 69.29,39.42 J3.8
LCD_MOSI  (via drill 0.51)
  Top 0.203: v28.04,24.79 28.04,20.12 26.21,18.29 25.4,18.29 J1.34 | v57.71,6.5 58.93,5.28 60.76,5.28 IC2.37
  Route2 0.203: v57.71,6.5 51,6.5 32.62,24.89 28.14,24.89 v28.04,24.79
  Bottom 0.203: v28.04,24.79 36.17,32.92 36.17,38.41 36.37,38.61 36.37,39.42 J3.34
LCD_RST  (via drill 0.51)
  Top 0.203: J1.47 25.4,11.79 26.21,11.79 31.7,17.27 31.7,17.88 R4.1 31.7,18.09 31.09,18.69 v30.48,18.69 | v23.77,25.4 23.57,25.6 23.57,29.26 24.59,30.28 25.2,30.28 J1.10 | v74.78,18.9 75.79,17.88 77.62,17.88 IC2.12
  Route2 0.203: v30.48,18.69 29.38,18.69 23.77,24.3 v23.77,25.4 | v74.78,18.9 74.17,18.29 68.48,18.29 67.87,18.89 67.87,21.54 50.29,39.12 50.29,41.44 49.73,42 J3.23
  Route15 0.203: v23.77,25.4 23.77,27.84 35.05,39.12 35.05,42.87 35.56,43.38 47.95,43.38 49.06,42.27 J3.23
LCD_SCLK  (via drill 0.51)
  Top 0.203: v23.16,32.92 22.35,32.11 22.35,18.9 23.98,17.27 25.2,17.27 J1.36 | v58.93,14.22 60.76,14.22 IC2.30
  Route2 0.203: v23.16,32.92 23.16,38.3 28.75,43.88 52.32,43.88 52.84,43.37 52.84,40.44 53.81,39.46 J3.20
  Route15 0.203: v58.93,14.22 60.65,14.22 63.6,17.18 63.6,18.49 59.12,22.97 58.11,22.97 54.25,26.82 54.25,39.42 J3.20
N$1
  Top 0.203: R2.1 42.88,21.74 42.88,22.55 44.09,23.77 R1.1
N$2
  Top 0.203: R1.2 44.09,25.4 39.22,20.52 39.22,18.49 38.81,18.09 37.59,18.09 36.58,17.07 36.58,13.61 37.19,13.01 39.42,13.01 39.62,12.8 39.62,11.18 39.22,10.77 34.14,10.77 32.31,8.94 25.2,8.94 23.37,7.11 19.71,7.11 18.69,8.13 18.69,29.67 22.76,33.73 25.2,33.73 J1.3 25.4,33.73 25.4,34.14 J1.2
N$3
  Top 0.203: Q1.3 44.3,21.13 42.88,19.71 R2.2
N$4
  Top 0.203: U1.6 44.09,12.8 44.09,13.21 U1.5
N$6
  Top 0.203: U1.16 49.25,14.25 49.3,14.2 49.3,9.1 C3.1
N$7
  Top 0.203: R13.2 51.82,27.64 52.63,27.64 59.54,34.54 60.55,34.54 D7.1
N$9
  Top 0.203: U1.19 47.35,16.05 50.19,16.05 51.61,17.48 53.03,17.48 53.24,17.27 53.24,13.41 54.46,12.19 54.86,12.19 Q2.2 55.07,11.99 56.08,10.97 56.08,7.11 55.27,6.3 55.27,5.49 R6.2
N$10
  Top 0.203: Q3.1 53.24,7.92 53.24,5.08 54.66,3.66 55.07,3.66 R6.1
N$11
  Top 0.203: Q2.1 53.03,11.99 51.21,11.99 R5.1
N$12
  Top 0.203: D2.C 39.83,34.54 36.58,34.54 R7.2
N$13
  Top 0.203: R12.2 54.25,27.64 55.07,27.64 60.55,33.12 D7.2
N$14
  Top 0.203: R14.2 56.69,27.64 60.55,31.5 D7.3
N$15
  Top 0.203: R8.1 41.25,30.07 41.25,31.5 42.06,32.31 D3.A
N$16
  Top 0.203: R9.1 45.92,30.07 45.92,30.89 44.5,32.31 D4.A
N$17
  Top 0.203: D5.A 46.74,32.51 47.75,32.51 48.97,33.73 R10.1
N$80  (via drill 0.51)
  Top 0.203: v74.78,29.26 73.36,29.26 71.53,31.09 71.53,31.9 JP1.1
  Bottom 0.203: v74.78,29.26 77.92,26.12 77.92,9.44 74.78,6.3 68.48,6.3 67.26,7.52 66.04,7.52 X2.1
NC_1  (via drill 0.51)
  Top 0.203: v68.89,24.18 68.89,22.96 63.2,17.27 62.38,17.27 61.98,17.68 60.96,17.68 IC2.27
  Route15 0.203: v68.89,24.18 68.89,34.76 65.53,38.12 65.53,40.43 65.22,40.74 63.09,40.74 61.81,39.46 J3.14
NC_2  (via drill 0.51)
  Top 0.203: v58.73,19.3 58.73,17.88 59.94,16.66 60.76,16.66 IC2.28
  Bottom 0.203: v58.73,19.3 58.73,22.35 57.3,23.77 57.3,37.8 59.13,39.62 J3.16
NC_3  (via drill 0.51)
  Top 0.203: v62.59,11.99 62.18,11.58 60.96,11.58 IC2.32
  Route15 0.203: v62.59,11.99 62.59,15.45 64.01,16.88 64.01,18.71 59.74,22.98 59.74,32.05 55.37,36.42 55.37,40.03 54.66,40.74 49.99,40.74 49.47,40.22 49.06,39.63 J3.24
SCL0  (via drill 0.51)
  Top 0.203: U2.4 20.93,42.27 21.95,43.28 26.42,43.28 27.43,42.27 27.43,38.81 28.04,38.2 37.59,38.2 38.81,39.42 J3.32 | v27.03,14.22 26.01,13.21 25.4,13.21 J1.44 | v58.93,6.5 60.76,6.5 IC2.36
  Route2 0.203: v58.93,6.5 58.93,5.69 50.58,5.69 43.67,12.6 27.65,12.6 27.03,13.22 v27.03,14.22
  Bottom 0.203: v27.03,14.22 27.03,22.55 38.61,34.14 38.61,38.41 38.81,38.61 38.81,39.42 J3.32
SD_0  (via drill 0.51)
  Top 0.203: v65.02,26.62 64.01,25.6 60.96,25.6 IC2.21
  Route2 0.203: v65.02,26.62 65.02,26.22 65.84,25.41 66.25,25.41 77.81,36.97 77.81,38.65 J3.2
SD_1  (via drill 0.51)
  Top 0.203: v66.24,26.62 64.01,24.38 60.96,24.38 IC2.22
  Route2 0.203: v66.24,26.62 66.64,27.02 66.64,31.69 74.37,39.42 J3.4
SD_2  (via drill 0.51)
  Top 0.203: v76,24.18 77.62,24.18 IC2.17
  Route15 0.203: v76,24.18 62.69,10.88 60.76,10.88 60.76,10.94 55,16.7 55,20.36 52.6,22.76 49.17,22.76 49.17,26.93 37.59,38.52 37.59,41.34 36.93,42 J3.33
SD_3  (via drill 0.51)
  Top 0.203: v76,25.4 77.62,25.4 IC2.18
  Route2 0.203: v76,25.4 77.82,23.58 77.82,16.47 77.2,15.85 68.42,15.85 68.27,16 64.2,16 58.47,10.27 53.34,10.27 42.88,20.73 42.88,31.09 35.05,38.92 35.05,41.14 34.19,42 J3.35
SD_CLK  (via drill 0.51)
  Top 0.203: v42.06,27.03 44.3,27.03 45.11,26.21 45.11,22.15 45.92,21.34 46.74,21.34 47.35,20.73 47.35,20.52 48.16,19.71 52.22,19.71 59.13,26.62 60.76,26.62 IC2.20
  Route2 0.203: v42.06,27.03 41.86,27.03 29.97,38.92 29.97,41.74 29.71,42 J3.39
SD_CMD  (via drill 0.51)
  Top 0.203: v61.37,43.69 77.22,43.69 79.14,41.77 79.14,29.55 77.83,28.25 77.83,26.82 IC2.19
  Bottom 0.203: v61.37,43.69 32.72,43.69 31.09,42.06 J3.37
SDA0  (via drill 0.51)
  Top 0.203: v41.05,36.98 33,36.98 | 33,36.98 28.65,36.98 27.03,38.61 27.03,42.06 26.21,42.88 24.99,42.88 24.38,42.27 22.15,42.27 U2.3 | v57.71,15.65 57.71,12.6 59.94,10.36 60.76,10.36 IC2.33 | J1.45 24.05,12.75 v23.5,12.2 | v32.6,35 33,35.4 33,36.98
  Route15 0.203: v41.05,36.98 50.08,27.95 50.08,23.77 53,23.77 56,20.77 56,17.25 57.61,15.65 v57.71,15.65 | v32.6,35 32.3,34.7 32.3,31.3 21.8,20.8 21.8,13.9 v23.5,12.2
  Bottom 0.203: v41.05,36.98 44.3,36.98 46.33,39.01 46.33,39.42 J3.26
SENS_VN  (via drill 0.51)
  Top 0.203: v75.29,9.47 76.39,9.47 76.71,9.14 77.62,9.14 IC2.5
  Route15 0.203: v75.29,9.47 75.29,9.77 76.81,11.29 76.81,29.48 68.07,38.22 68.07,41.24 67.31,42 J3.9
SENS_VP  (via drill 0.51)
  Top 0.203: v75.29,8.25 76.48,8.25 77.01,7.72 77.62,7.72 IC2.4
  Route15 0.203: v75.29,8.25 75.39,8.25 77.22,10.08 77.22,32.51 70.61,39.12 70.61,41.44 70.05,42 J3.7
VIN
  Top 0.203: C2.1 45.25,10.45 U1.8 U1.7
  Top 0.305: D1.A 40.92,9 C1.1 C2.1
  Top 0.406: J2.1 22.7,6.1 23.1,6.5 23.8,6.5 25.7,8.4 33.6,8.4 33.7,8.3 | 33.7,8.3 X1.1 | 33.7,8.3 39.58,8.3 D1.A
VIN_PROT
  Top 0.406: D1.C 40.6,13.9 40.19,14.31 U$1.3 38.1,17.1 C4.1

### Text on the board
tNames: SensorIoT Display V0.1